# EAGLE design max1551_charger_v1 (EAGLE 8.4.1)
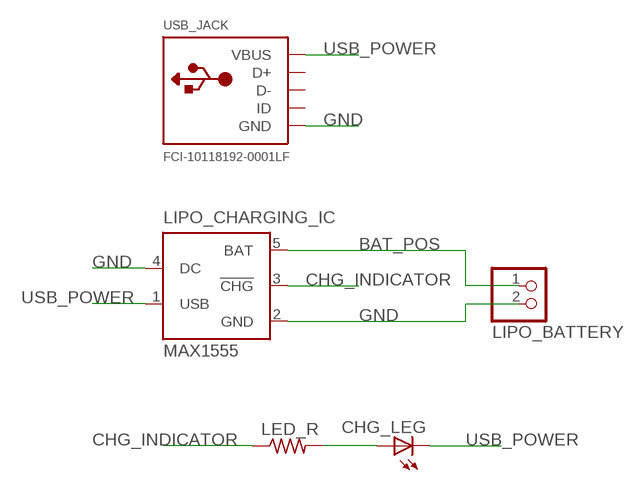
[diagram p0: schematic, sheet 1]

## Parts
CHG_LEG  LED3MM  [LED3MM]
LED_R  R-US_0207/2V  [0207/2V]
LIPO_BATTERY  JST_2PIN-SMT-RA  [JST-PH-2-SMT-RA]
LIPO_CHARGING_IC  MAX1555  [SOT23-5L]
USB_JACK  FCI-10118192-0001LF  [FCI-10118192-0001LF]

## Nets
BAT_POS: LIPO_BATTERY.1 LIPO_CHARGING_IC.5(BAT)
CHG_INDICATOR: LED_R.1 LIPO_CHARGING_IC.3(!CHG)
GND: LIPO_BATTERY.2 LIPO_CHARGING_IC.2(GND) LIPO_CHARGING_IC.4(DC) USB_JACK.GND
N$1: CHG_LEG.A LED_R.2
USB_POWER: CHG_LEG.K(C) LIPO_CHARGING_IC.1(USB) USB_JACK.VCC(VBUS)
Unconnected: USB_JACK.NC@0(ID) USB_JACK.RX(D+) USB_JACK.TX(D-)

## Library data of the parts
CHG_LEG = adafruit:LED: LED OSRAM: - CHIPLED LG R971, LG N971, LY N971, LG Q971, LY Q971, LO R971, LY R971 LH N974, LH R974 LS Q976, LO Q976, LY Q976 LO Q996 - Hyper CHIPLED LW Q18S LB Q993, LB Q99A, LB R99A - SideLED LS A670, LO A670, LY A670, LG A670, LP A670 LB A673, LV A673, LT A673, LW A673 LH A674 LY A675 LS A676, LA A676, LO A676, LY A676, LW A676 LS A679, LY A679, LG A679 - Hyper Micro SIDELED® LS Y876, LA Y876, LO Y876, LY Y876 LT Y87S - SmartLED LW L88C, LW L88S LB L89C, LB L89S, LG L890 LS L89K, LO L89K, LY L89K LS L896, LA L896, LO L896, LY L896 - TOPLED LS T670, LO T670, LY T670, LG T670, LP T670 LSG T670, LSP T670, LSY T670, LOP T670, LYG T670 LG T671, LOG T671, LSG T671 LB T673, LV T673, LT T673, LW T673 LH T674 LS T676, LA T676, LO T676, LY T676, LB T676, LH T676, LSB T676, LW T676 LB T67C, LV T67C, LT T67C, LS T67K, LO T67K, LY T67K, LW E67C LS E67B, LA E67B, LO E67B, LY E67B, LB E67C, LV E67C, LT E67C LW T67C LS T679, LY T679, LG T679 LS T770, LO T770, LY T770, LG T770, LP T770 LB T773, LV T773, LT T773, LW T773 LH T774 LS E675, LA E675, LY E675, LS T675 LS T776, LA T776, LO T776, LY T776, LB T776 LHGB T686 LT T68C, LB T68C - Hyper Mini TOPLED® LB M676 - Mini TOPLED Santana® LG M470 LS M47K, LO M47K, LY M47K Source: http://www.osram.convergy.de/
LED_R = rcl:R-US_: RESISTOR, American symbol
LIPO_BATTERY = adafruit:JST_2PIN: JST 2-Pin Connectors of various flavors SMT-RA (S2B-PH-SM4) 4UConnector #17311 SMT (B2B-PH-SM4) THM-RA (S2B-PH) THM (B2B-PH)
LIPO_CHARGING_IC = maxim:MAX1555: Dual-Input USB/AC Adapter 1-Cell Li+ Battery Chargers Source: http://www.maxim-ic.com .. MAX1551-MAX1555.pdf; MF: MAXIM; MPN: MAX1555EZK+T; OC_FARNELL: 1628222; OC_NEWARK: 59J2761
USB_JACK = ravestrapon:FCI-10118192-0001LF

## Board
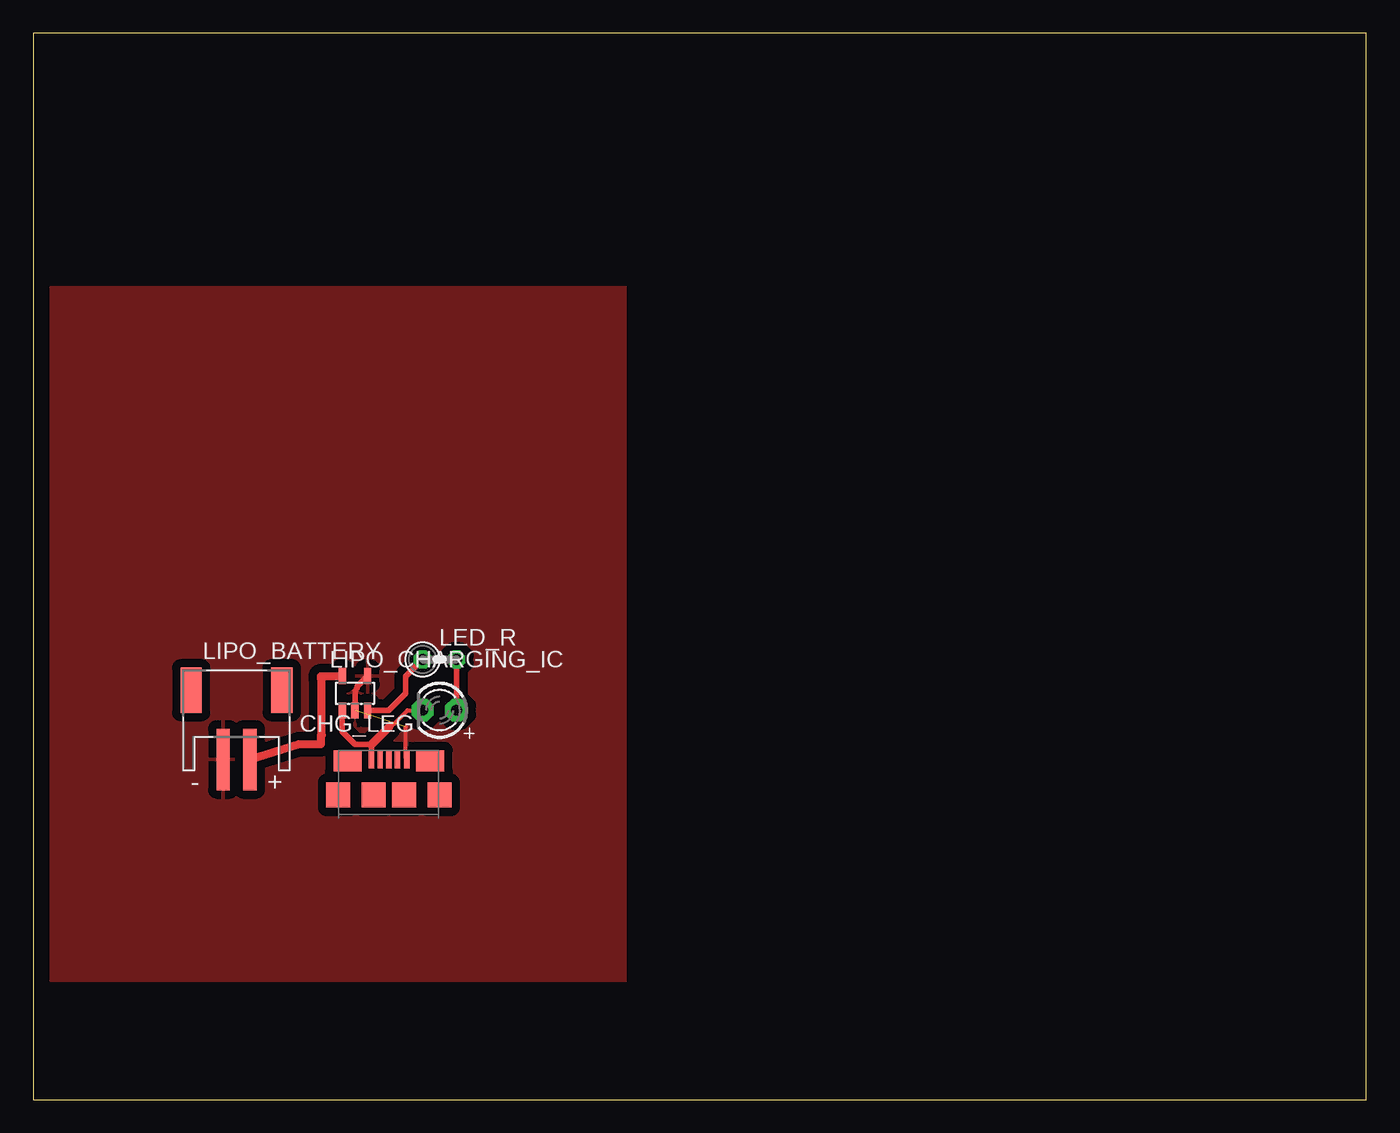
[diagram p1: board, top side]

Size 100 x 80 mm. Coordinates in mm from the lower left corner, seen from the top.
Outline: 0,0 100,0 100,80 0,80 0,0
Copper layers (1*16): Top 0.035mm / dielectric 1.5mm / Bottom 0.035mm
Design rules "default *": minimum track width 6mil, minimum drill 0.35mm, track to track 25mil, track to pad 25mil, pad to pad 25mil, via to via 25mil, smd to smd 25mil, copper to edge 40mil, drill to drill 6mil, minimum pad ring 10mil, minimum via ring 8mil, stop-mask expansion 4mil, vias tented up to drill 0mil, thermal gap 25mil

### Footprints (pad centres in the part's own frame; a part is rotated, then mirrored left to right if it is on the bottom)
LED3MM = drill 0.813 pad 1.676 octagon: A -1.27,0; K 1.27,0
0207/2V = drill 0.813 octagon: 1 -1.27,0; 2 1.27,0
JST-PH-2-SMT-RA = smd 1 x 4.6: 1 1,-3.7; 2 -1,-3.7 | smd 1.6 x 3.4: NC1 -3.4,1.5; NC2 3.4,1.5
SOT23-5L = smd 0.55 x 1.2: 1 -0.95,-1.3; 2 0,-1.3; 3 0.95,-1.3; 4 0.95,1.3; 5 -0.95,1.3
FCI-10118192-0001LF = smd 0.4 x 1.35: GND 1.35,2.675; NC@0 0.65,2.675; RX -0.65,2.675; TX 0,2.675; VCC -1.3,2.675 | smd 1.8 x 1.9: NC@1 -1.15,0; NC@2 -3.8,0; NC@4 1.15,0; NC@5 3.8,0 | smd 2.1 x 1.6: NC@3 -3.1,2.55; NC@6 3.1,2.55

### Placement (x,y rotation side)
CHG_LEG  30.48,29.21 180 top
LED_R  30.48,33.02 0 top
LIPO_BATTERY  15.24,29.21 0 top
LIPO_CHARGING_IC  24.13,30.48 0 top
USB_JACK  26.67,22.86 0 top

### Tracks (layer width: path | path; a pad name or v marks a point on that pad's centre or on a via)
BAT_POS
  Top 0.61: LIPO_BATTERY.1 19.94,26.67 21.59,26.67 21.59,27.29 21.65,27.35 21.65,31.53 21.59,31.59 21.59,31.75 21.62,31.78 LIPO_CHARGING_IC.5
CHG_INDICATOR
  Top 0.406: LIPO_CHARGING_IC.3 26.64,29.18 27.94,30.48 27.94,31.75 LED_R.1
GND  (1 unrouted)
  Top 0.305: USB_JACK.GND 27.94,25.61 27.94,27.94
  Top 0.406: LIPO_CHARGING_IC.4 24.29,30.99 24.29,30.83 24.13,30.67 LIPO_CHARGING_IC.2
  pour Top: 1.27,60.96 1.27,8.89 44.45,8.89 44.45,60.96
N$1
  Top 0.406: LED_R.2 CHG_LEG.A
USB_POWER
  Top 0.305: 26.77,28.04 26.92,28.19 27.05,28.19 28.07,29.21 CHG_LEG.K
  Top 0.406: USB_JACK.VCC 25.37,26.64 | 25.37,26.64 25.4,26.67 | LIPO_CHARGING_IC.1 23.18,27.62 24.16,26.64 25.37,26.64
  Top 0.61: 25.37,26.64 26.77,28.04